# EAGLE design schm (EAGLE 9.6.2)
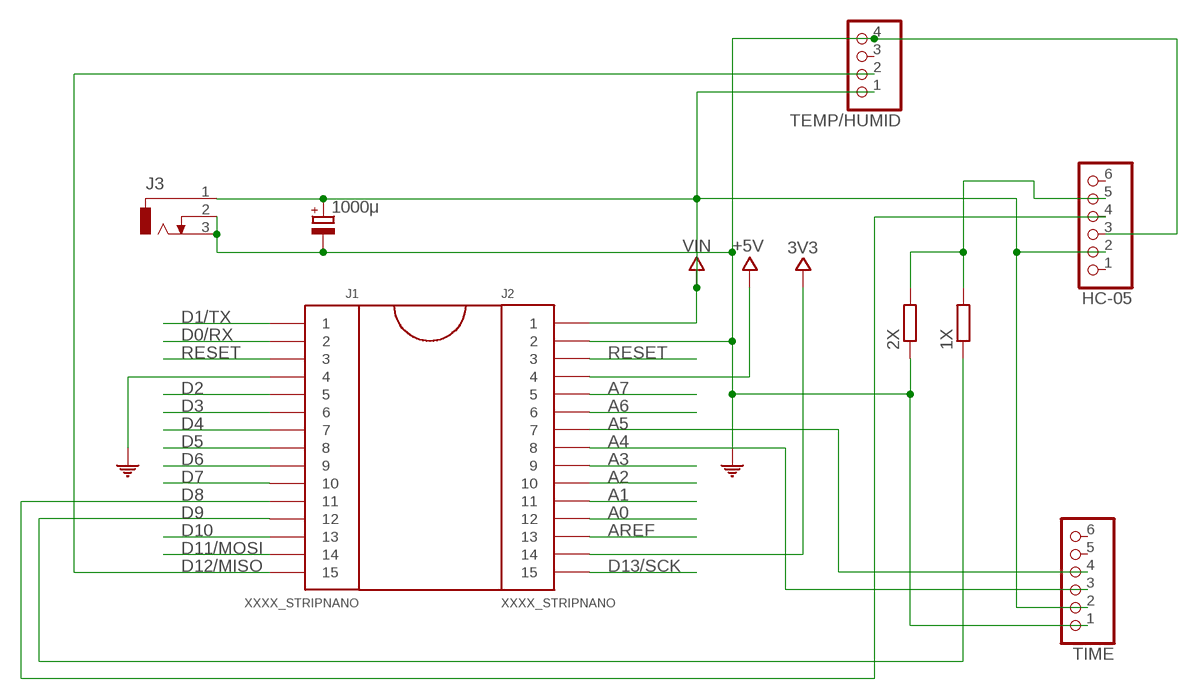
[diagram p0: schematic, sheet 1]

## Parts
1X  R-EU_0207/10  [0207/10]
2X  R-EU_0207/10  [0207/10]
1000μ  CPOL-EUE3.5-10  [E3,5-10]
HC-05  PINHD-1X6/90  [1X06/90]
J1  XXXX_STRIPNANO  [HEAD15-NOSS]
J2  XXXX_STRIPNANO  [HEAD15-NOSS]
J3  DCJ0303  [DCJ0303]
TEMP/HUMID  PINHD-1X4  [1X04]
TIME  PINHD-1X6/90  [1X06/90]

## Nets
3V3: J2.14
+5V: J2.4
A0: J2.12
A1: J2.11
A2: J2.10
A3: J2.9
A4: J2.8 TIME.3
A5: J2.7 TIME.4
A6: J2.6
A7: J2.5
AREF: J2.13
COM: 2X.1 1000μ.- HC-05.3 J1.4 J2.2 J3.2 J3.3 TEMP/HUMID.4 TIME.1
D0/RX: J1.2
D1/TX: J1.1
D2: J1.5
D3: J1.6
D4: J1.7
D5: J1.8
D6: J1.9
D7: J1.10
D8: HC-05.4 J1.11
D9: 1X.1 J1.12
D10: J1.13
D11/MOSI: J1.14
D12/MISO: J1.15 TEMP/HUMID.2
D13/SCK: J2.15
N$1: 1X.2 2X.2 HC-05.5
RESET: J1.3 J2.3
VIN: 1000μ.+ HC-05.2 J2.1 J3.1 TEMP/HUMID.1 TIME.2
Unconnected: HC-05.1 HC-05.6 TEMP/HUMID.3 TIME.5 TIME.6

## Library data of the parts
1X 2X = rcl:R-EU_: RESISTOR, European symbol; SPICEPREFIX: R
1000μ = rcl:CPOL-EU: POLARIZED CAPACITOR, European symbol; SPICEPREFIX: C
HC-05 TIME = pinhead:PINHD-1X6: PIN HEADER
J1 J2 = Connettori:XXXX_STRIPNANO: Strip passo 2,54 a 15 pin per Arduino Nano; VALUE: Strip15pin
J3 = con-jack:DCJ0303: DC POWER JACK Source: DCJ0303.pdf; OC_FARNELL: unknown; OC_NEWARK: unknown
TEMP/HUMID = pinhead:PINHD-1X4: PIN HEADER

## Board
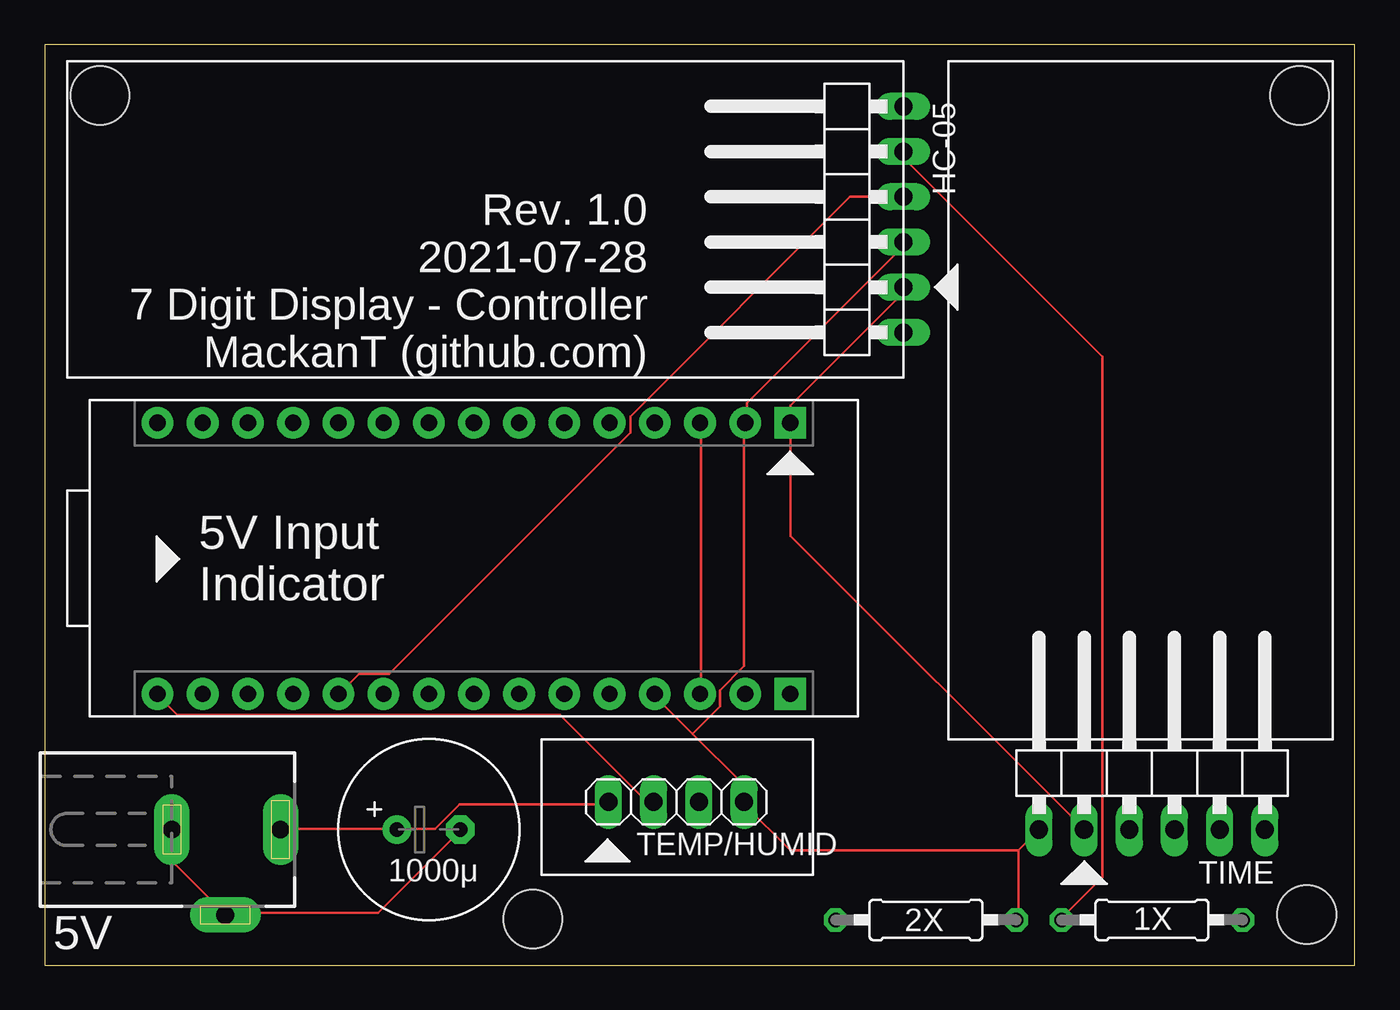
[diagram p1: board, top side]
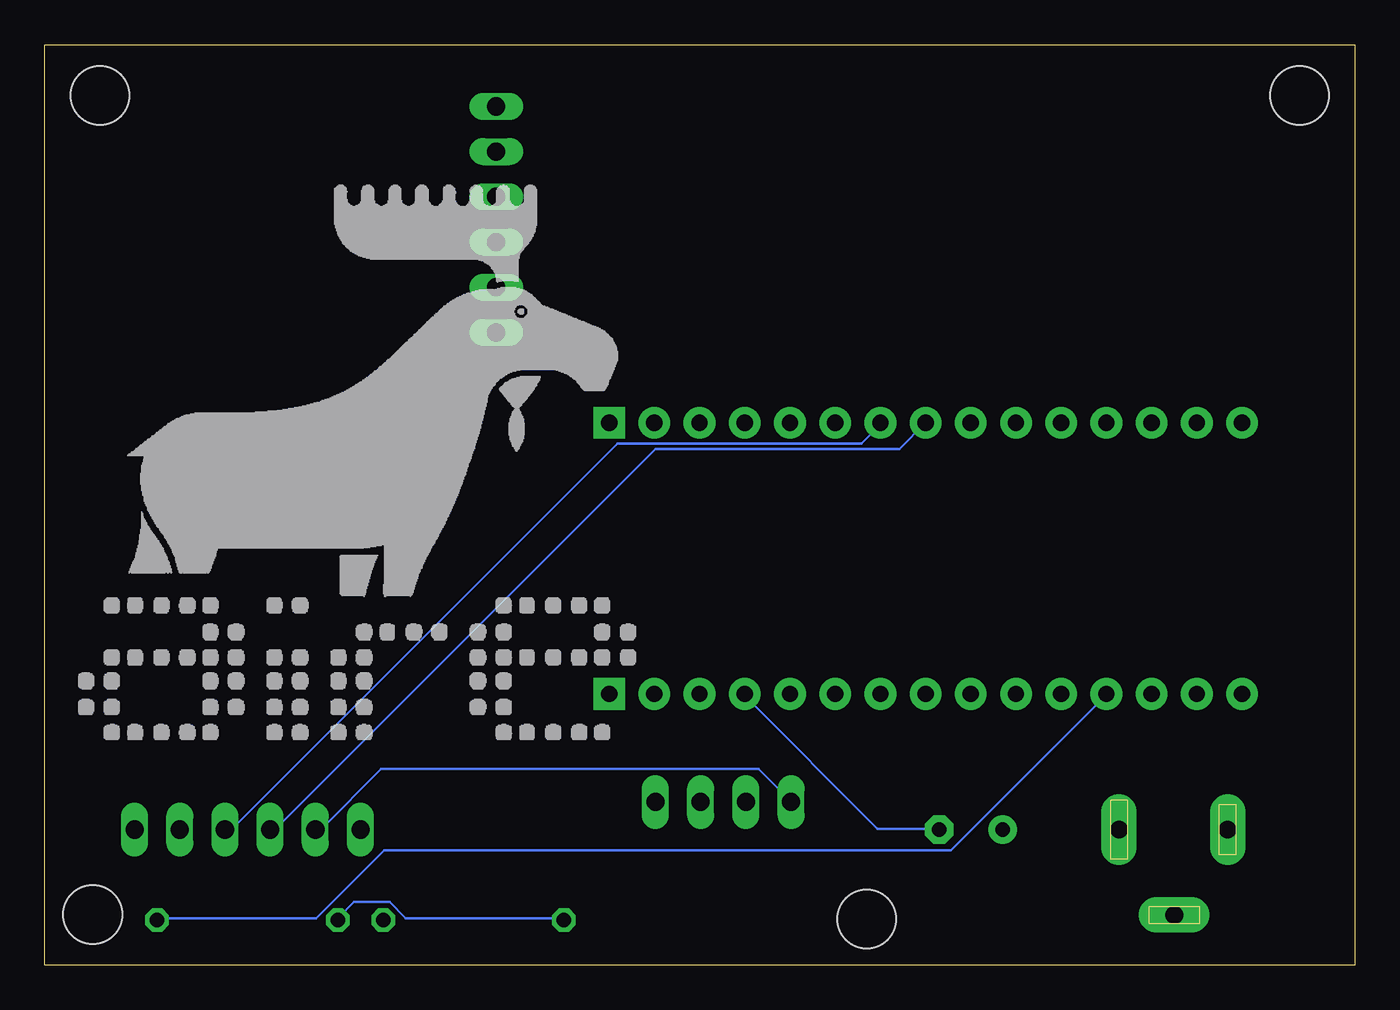
[diagram p2: board, bottom side, seen from below]

Size 73.64 x 51.74 mm. Coordinates in mm from the lower left corner, seen from the top.
Outline: 0,0 73.64,0 73.64,51.74 0,51.74 0,0
Copper layers (1*16): Top 0.035mm / dielectric 1.5mm / Bottom 0.035mm
Design rules "default": minimum track width 6mil, minimum drill 0.35mm, track to track 6mil, track to pad 6mil, pad to pad 6mil, via to via 6mil, smd to smd 6mil, copper to edge 40mil, drill to drill 6mil, minimum pad ring 10mil, minimum via ring 8mil, stop-mask expansion 4mil, vias tented up to drill 0mil, thermal gap 10mil
Holes 3.3 mm at 70.93,2.83 70.53,48.88 3.13,48.88 27.43,2.58

### Footprints (pad centres in the part's own frame; a part is rotated, then mirrored left to right if it is on the bottom)
0207/10 = drill 0.813 octagon: 1 -5.08,0; 2 5.08,0
E3,5-10 = drill 0.813 pad 1.6: + -1.778,0 | drill 0.813 pad 1.6 octagon: - 1.778,0
1X06/90 = drill 1.016 long: 1 -6.35,-3.81; 2 -3.81,-3.81; 3 -1.27,-3.81; 4 1.27,-3.81; 5 3.81,-3.81; 6 6.35,-3.81
HEAD15-NOSS = drill 0.914 pad 1.778 square: 1 0,0 | drill 0.914 pad 1.778: 2 2.54,0; 3 5.08,0; 4 7.62,0; 5 10.16,0; 6 12.7,0; 7 15.24,0; 8 17.78,0; 9 20.32,0; 10 22.86,0; 11 25.4,0; 12 27.94,0; 13 30.48,0; 14 33.02,0; 15 35.56,0
DCJ0303 = drill 1 pad 2 long: 1 0,3.1; 2 4.8,0; 3 0,-3
1X04 = drill 1.016 long: 1 -3.81,0; 2 -1.27,0; 3 1.27,0; 4 3.81,0

### Placement (x,y rotation side)
1X  62.23,2.54 180 top
2X  49.53,2.54 180 top
1000μ  21.59,7.62 0 top
HC-05  44.45,41.91 90 top
J1  41.91,15.24 180 top
J2  41.91,30.48 180 top
J3  10.16,7.62 270 top
TEMP/HUMID  35.5,9.17 0 top
TIME  62.23,11.43 0 top

### Tracks (layer width: path | path; a pad name or v marks a point on that pad's centre or on a via)
A4
  Bottom 0.152: J2.8 25.6,29.01 39.32,29.01 60.66,7.67 60.96,7.67 TIME.3
A5
  Bottom 0.152: TIME.4 63.4,7.67 63.09,7.67 41.45,29.31 27.74,29.31 26.67,30.38 J2.7
COM
  Top 0.152: HC-05.3 48.16,40.59 48.16,40.28 39.47,31.6 39.47,30.53 J2.2 39.32,30.38 39.32,16.81 37.95,15.44 37.95,14.53 36.42,13 | J3.3 7.16,7.52 7.16,5.84 10.06,2.95 J3.2 10.21,2.95 18.74,2.95 23.32,7.52 1000μ.- | 54.71,6.45 54.71,2.64 2X.1 | TIME.1 54.71,6.45 | 36.42,13 34.29,15.14 J1.4 | 36.42,13 39.17,10.26 39.17,9.2 TEMP/HUMID.4 39.32,9.04 41.91,6.45 54.71,6.45
  Bottom 0.152: 1000μ.- 23.47,7.67 26.82,7.67 34.29,15.14 J1.4
D8
  Top 0.152: HC-05.4 45.26,43.18 32.92,30.84 32.92,29.92 19.36,16.36 17.68,16.36 16.61,15.29 J1.11
D9
  Bottom 0.152: 1X.1 67.21,2.64 58.37,2.64 54.56,6.45 22.71,6.45 14.02,15.14 J1.12
D12/MISO
  Top 0.152: TEMP/HUMID.2 34.14,9.2 33.83,9.2 28.96,14.07 7.47,14.07 6.4,15.14 J1.15
N$1
  Top 0.152: HC-05.5 48.31,45.62 48.31,45.31 59.44,34.19 59.44,4.93 57.15,2.64 1X.2
  Bottom 0.152: 2X.2 44.5,2.64 53.34,2.64 54.25,3.56 56.24,3.56 57.15,2.64 1X.2
RESET
  Top 0.152: J1.3 36.88,15.29 36.88,30.38 J2.3
VIN
  Top 0.152: HC-05.2 48.16,38 48.16,37.69 41.91,31.45 J2.1 41.91,24.13 TIME.2 | 19.81,7.67 13.41,7.67 J3.1 | 19.81,7.67 21.95,7.67 23.32,9.04 31.55,9.04 TEMP/HUMID.1 | 19.81,7.67 1000μ.+
  Bottom 0.152: TIME.2 58.37,7.67 58.06,7.67 54.71,11.02 33.53,11.02 31.7,9.2 TEMP/HUMID.1

### Text on the board
tNames: Rev. 1.0 / 2021-07-28 / 7 Digit Display - Controller / MackanT (github.com) | 5V Input / Indicator | 5V